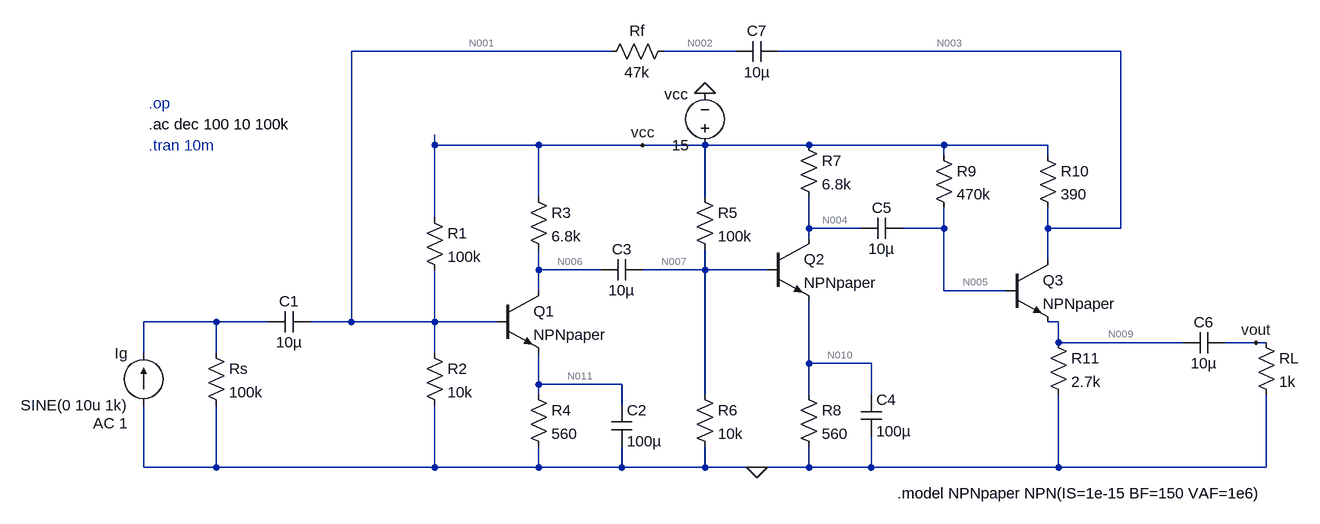
[diagram p0: schematic HW7-Exemplo2.asc]
HW7-Exemplo2.asc, the LTspice schematic file:
Version 4.1
SHEET 1 1876 680
WIRE 640 -320 240 -320
WIRE 832 -320 720 -320
WIRE 1424 -320 896 -320
WIRE 368 -176 368 -192
WIRE 528 -176 368 -176
WIRE 688 -176 528 -176
WIRE 784 -176 688 -176
WIRE 944 -176 784 -176
WIRE 1152 -176 944 -176
WIRE 1312 -176 1152 -176
WIRE 1152 -160 1152 -176
WIRE 1312 -160 1312 -176
WIRE 528 -96 528 -176
WIRE 784 -96 784 -176
WIRE 368 -64 368 -176
WIRE 944 -48 944 -96
WIRE 1024 -48 944 -48
WIRE 1152 -48 1152 -80
WIRE 1152 -48 1088 -48
WIRE 1312 -48 1312 -80
WIRE 1424 -48 1424 -320
WIRE 1424 -48 1312 -48
WIRE 944 -32 944 -48
WIRE 1312 0 1312 -48
WIRE 528 16 528 -16
WIRE 624 16 528 16
WIRE 784 16 784 -16
WIRE 784 16 688 16
WIRE 880 16 784 16
WIRE 528 48 528 16
WIRE 1152 48 1152 -48
WIRE 1248 48 1152 48
WIRE 32 96 -80 96
WIRE 112 96 32 96
WIRE 240 96 240 -320
WIRE 240 96 176 96
WIRE 368 96 368 16
WIRE 368 96 240 96
WIRE 464 96 368 96
WIRE 1328 96 1312 96
WIRE 1328 128 1328 96
WIRE 1520 128 1328 128
WIRE 1632 128 1584 128
WIRE 1648 128 1632 128
WIRE -80 144 -80 96
WIRE 32 144 32 96
WIRE 368 144 368 96
WIRE 944 160 944 64
WIRE 1040 160 944 160
WIRE 528 192 528 144
WIRE 656 192 528 192
WIRE 528 208 528 192
WIRE 784 208 784 16
WIRE 944 208 944 160
WIRE 1040 208 1040 160
WIRE 656 224 656 192
WIRE -80 320 -80 224
WIRE 32 320 32 224
WIRE 32 320 -80 320
WIRE 368 320 368 224
WIRE 368 320 32 320
WIRE 528 320 528 288
WIRE 528 320 368 320
WIRE 656 320 656 288
WIRE 656 320 528 320
WIRE 784 320 784 288
WIRE 784 320 656 320
WIRE 864 320 784 320
WIRE 944 320 944 288
WIRE 944 320 864 320
WIRE 1040 320 1040 272
WIRE 1040 320 944 320
WIRE 1328 320 1328 208
WIRE 1328 320 1040 320
WIRE 1648 320 1648 208
WIRE 1648 320 1328 320
FLAG 864 320 0
FLAG 688 -176 vcc
FLAG 784 -256 0
FLAG 1632 128 vout
SYMBOL res 16 128 R0
SYMATTR InstName Rs
SYMATTR Value 100k
SYMBOL cap 176 80 R90
WINDOW 0 0 32 VBottom 2
WINDOW 3 32 32 VTop 2
SYMATTR InstName C1
SYMATTR Value 10µ
SYMBOL npn 464 48 R0
SYMATTR InstName Q1
SYMATTR Value NPNpaper
SYMBOL res 352 -80 R0
SYMATTR InstName R1
SYMATTR Value 100k
SYMBOL res 352 128 R0
SYMATTR InstName R2
SYMATTR Value 10k
SYMBOL res 512 -112 R0
SYMATTR InstName R3
SYMATTR Value 6.8k
SYMBOL res 512 192 R0
SYMATTR InstName R4
SYMATTR Value 560
SYMBOL cap 640 224 R0
SYMATTR InstName C2
SYMATTR Value 100µ
SYMBOL cap 688 0 R90
WINDOW 0 0 32 VBottom 2
WINDOW 3 32 32 VTop 2
SYMATTR InstName C3
SYMATTR Value 10µ
SYMBOL res 768 -112 R0
SYMATTR InstName R5
SYMATTR Value 100k
SYMBOL res 768 192 R0
SYMATTR InstName R6
SYMATTR Value 10k
SYMBOL res 736 -336 R90
WINDOW 0 0 56 VBottom 2
WINDOW 3 32 56 VTop 2
SYMATTR InstName Rf
SYMATTR Value 47k
SYMBOL cap 896 -336 R90
WINDOW 0 0 32 VBottom 2
WINDOW 3 32 32 VTop 2
SYMATTR InstName C7
SYMATTR Value 10µ
SYMBOL npn 880 -32 R0
SYMATTR InstName Q2
SYMATTR Value NPNpaper
SYMBOL res 928 -192 R0
SYMATTR InstName R7
SYMATTR Value 6.8k
SYMBOL res 928 192 R0
SYMATTR InstName R8
SYMATTR Value 560
SYMBOL cap 1024 208 R0
SYMATTR InstName C4
SYMATTR Value 100µ
SYMBOL cap 1088 -64 R90
WINDOW 0 0 32 VBottom 2
WINDOW 3 32 32 VTop 2
SYMATTR InstName C5
SYMATTR Value 10µ
SYMBOL res 1136 -176 R0
SYMATTR InstName R9
SYMATTR Value 470k
SYMBOL res 1296 -176 R0
SYMATTR InstName R10
SYMATTR Value 390
SYMBOL res 1312 112 R0
SYMATTR InstName R11
SYMATTR Value 2.7k
SYMBOL res 1632 112 R0
SYMATTR InstName RL
SYMATTR Value 1k
SYMBOL cap 1584 112 R90
WINDOW 0 0 32 VBottom 2
WINDOW 3 32 32 VTop 2
SYMATTR InstName C6
SYMATTR Value 10µ
SYMBOL npn 1248 0 R0
SYMATTR InstName Q3
SYMATTR Value NPNpaper
SYMBOL current -80 224 R180
WINDOW 0 24 80 Left 2
WINDOW 3 24 0 Left 2
WINDOW 123 24 -28 Left 2
WINDOW 39 0 0 Left 0
SYMATTR InstName Ig
SYMATTR Value SINE(0 10u 1k)
SYMATTR Value2 AC 1
SYMBOL voltage 784 -160 R180
WINDOW 0 26 94 Left 2
WINDOW 3 24 16 Left 2
WINDOW 123 0 0 Left 0
WINDOW 39 0 0 Left 0
SYMATTR InstName vcc
SYMATTR Value 15
TEXT 1080 360 Left 2 !.model NPNpaper NPN(IS=1e-15 BF=150 VAF=1e6)
TEXT -72 -240 Left 2 ;.op
TEXT -72 -208 Left 2 !.ac dec 100 10 100k
TEXT -72 -176 Left 2 ;.tran 10m

The netlist it stands for:
* HW7-Exemplo2.asc
Rs N008 0 100k
C1 N001 N008 10µ
Q1 N006 N001 N011 0 NPNpaper
R1 vcc N001 100k
R2 N001 0 10k
R3 vcc N006 6.8k
R4 N011 0 560
C2 N011 0 100µ
C3 N007 N006 10µ
R5 vcc N007 100k
R6 N007 0 10k
Rf N002 N001 47k
C7 N003 N002 10µ
Q2 N004 N007 N010 0 NPNpaper
R7 vcc N004 6.8k
R8 N010 0 560
C4 N010 0 100µ
C5 N005 N004 10µ
R9 vcc N005 470k
R10 vcc N003 390
R11 N009 0 2.7k
RL vout 0 1k
C6 vout N009 10µ
Q3 N003 N005 N009 0 NPNpaper
Ig 0 N008 SINE(0 10u 1k) AC 1
vcc vcc 0 15
.model NPN NPN
.model PNP PNP
.lib standard.bjt
.model NPNpaper NPN(IS=1e-15 BF=150 VAF=1e6)
* .op
.ac dec 100 10 100k
* .tran 10m
.backanno
.end

* Results of the author's LTspice run, read from the files saved beside the schematic
* Operating Point, zero values left out:
*   V(n001) = 1.301 V
*   V(n002) = 1.301 V
*   V(n003) = 14.05 V
*   V(n004) = 7.942 V
*   V(n005) = 7.363 V
*   V(n006) = 7.942 V
*   V(n007) = 1.301 V
*   V(n009) = 6.625 V
*   V(n010) = 585.1 mV
*   V(n011) = 585.1 mV
*   V(vcc) = 15 V
*   I(R1) = 137 µA
*   I(R10) = 2.437 mA
*   I(R11) = 2.454 mA
*   I(R2) = 130.1 µA
*   I(R3) = 1.038 mA
*   I(R4) = 1.045 mA
*   I(R5) = 137 µA
*   I(R6) = 130.1 µA
*   I(R7) = 1.038 mA
*   I(R8) = 1.045 mA
*   I(R9) = 16.25 µA
*   I(vcc) = -4.803 mA
*   Ib(Q1) = 6.919 µA
*   Ib(Q2) = 6.919 µA
*   Ib(Q3) = 16.25 µA
*   Ic(Q1) = 1.038 mA
*   Ic(Q2) = 1.038 mA
*   Ic(Q3) = 2.437 mA
*   Ie(Q1) = -1.045 mA
*   Ie(Q2) = -1.045 mA
*   Ie(Q3) = -2.454 mA
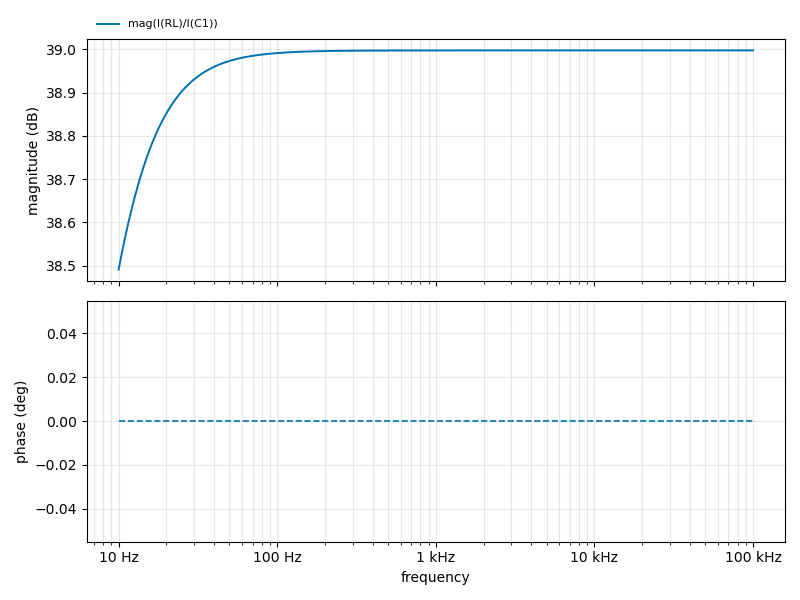
[diagram p1: AC Analysis of HW7-Exemplo2.asc, plotted from the saved traces]
* AC Analysis, 1 run:
*   mag(I(RL)/I(C1)): 38.49 dB at 10 Hz, 39.00 dB at 100 kHz, peak 39.00 dB at 100 kHz